# Altium schematic sheet DISPLAY.schdoc: =
size A4; Symbol: Sheet-Symbol_A4; Company: 嘉立创EDA; Version: V1.0; Page Size: A4; @Project Name: RK3568B2地瓜派; @Page Count: 27; @Update Date: 2025-09-23; @Create Date: 2025-09-11; @Schematic Name: Schematic1; @Page No: 25; @Page Name: DISPLAY; Device: Sheet-Symbol_A4; Border: 1; Title Block Position: 3; Width: 1170; Height: 825; Region Start: 1; X Region Count: 6; Y Region Count: 4; Blade Width: 10; @Board Name: Board1; @Create Time: 22:43:50; @Update Time: 10:18:57; Organization: ORGANIZATION; Address1: ADDRESS 1; Address2: ADDRESS 2; Address3: ADDRESS 3; Address4: ADDRESS 4; SheetNumber: 27; SheetTotal: 28
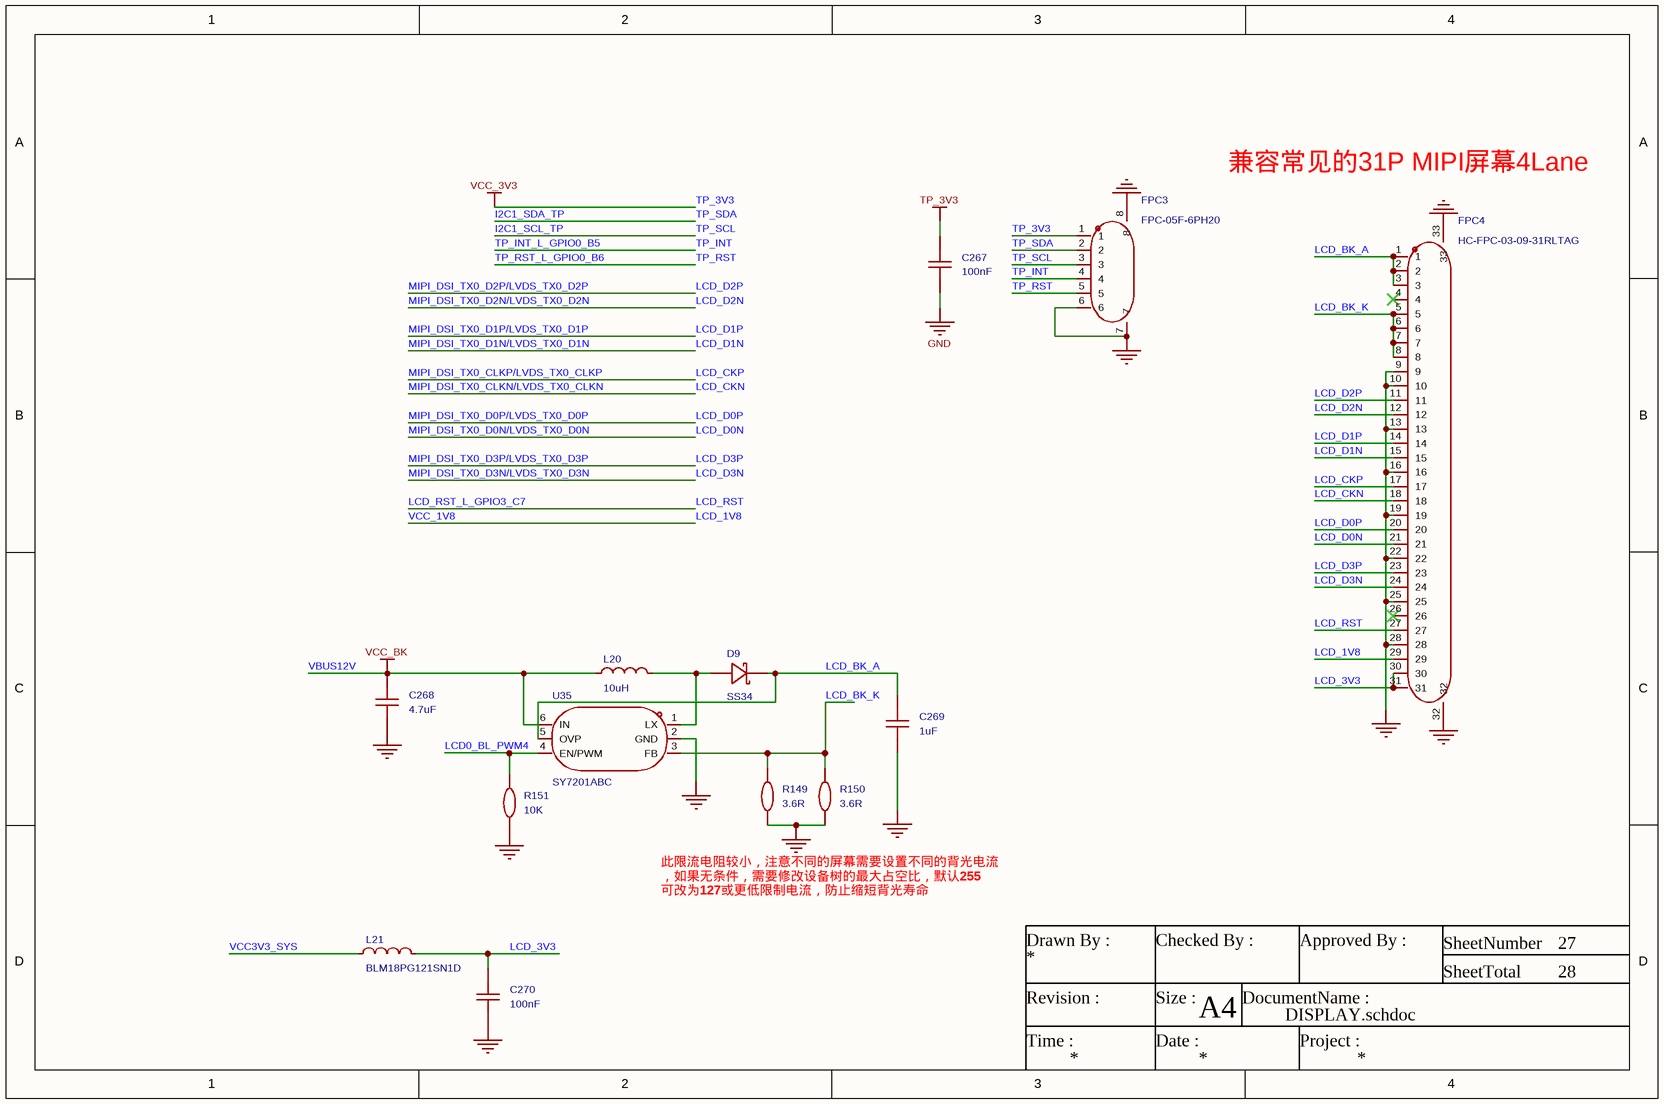
[diagram p0: DISPLAY.schdoc]

## Parts
C267  100nF  [C0603]
C268  4.7uF  [C0603]
C269  1uF  [C0603]
C270  100nF  [C0603]
D9  SS34  [SMA_L4.3-W2.6-LS5.0-FD]
FPC3  FPC-05F-6PH20  [FPC-SMD_6P-P0.50_XUNPU_FPC-05F-6PH20]
FPC4  HC-FPC-03-09-31RLTAG  [FPC-SMD_31P-P0.30_HC-FPC-03-09-31RLTAG]
L20  10uH  [IND-SMD_L2.5-W2.0]
L21  BLM18PG121SN1D  [L0603]
R149  3.6R  [R0603]
R150  3.6R  [R0603]
R151  10K  [R0402]
U35  SY7201ABC  [SOT-23-6_L2.9-W1.6-P0.95-LS2.8-BR]

## Nets
GND: C267.1 C268.1 C269.1 C270.1 FPC3.6 FPC3.7 FPC3.8 FPC4.9 FPC4.10 FPC4.13 FPC4.16 FPC4.19 FPC4.22 FPC4.25 FPC4.28 FPC4.32 FPC4.33 R149.1 R150.1 R151.1 U35.2(GND)
TP_3V3: C267.2 FPC3.1  [also labelled VCC_3V3]
VBUS12V: C268.2 L20.2 U35.6(IN)  [also labelled VCC_BK]
I2C1_SCL_TP: FPC3.3  [also labelled TP_SCL]
I2C1_SDA_TP: FPC3.2  [also labelled TP_SDA]
LCD0_BL_PWM4: R151.2 U35.4(EN/PWM)
LCD_1V8: FPC4.29  [also labelled VCC_1V8]
LCD_3V3: C270.2 FPC4.30 FPC4.31 L21.2
LCD_BK_A: C269.2 D9.2(K) FPC4.1 FPC4.2 FPC4.3 U35.5(OVP)
LCD_BK_K: FPC4.5 FPC4.6 FPC4.7 FPC4.8 R149.2 R150.2 U35.3(FB)
LCD_CKN: FPC4.18  [also labelled MIPI_DSI_TX0_CLKN/LVDS_TX0_CLKN]
LCD_CKP: FPC4.17  [also labelled MIPI_DSI_TX0_CLKP/LVDS_TX0_CLKP]
LCD_D0N: FPC4.21  [also labelled MIPI_DSI_TX0_D0N/LVDS_TX0_D0N]
LCD_D0P: FPC4.20  [also labelled MIPI_DSI_TX0_D0P/LVDS_TX0_D0P]
LCD_D1N: FPC4.15  [also labelled MIPI_DSI_TX0_D1N/LVDS_TX0_D1N]
LCD_D1P: FPC4.14  [also labelled MIPI_DSI_TX0_D1P/LVDS_TX0_D1P]
LCD_D2N: FPC4.12  [also labelled MIPI_DSI_TX0_D2N/LVDS_TX0_D2N]
LCD_D2P: FPC4.11  [also labelled MIPI_DSI_TX0_D2P/LVDS_TX0_D2P]
LCD_D3N: FPC4.24  [also labelled MIPI_DSI_TX0_D3N/LVDS_TX0_D3N]
LCD_D3P: FPC4.23  [also labelled MIPI_DSI_TX0_D3P/LVDS_TX0_D3P]
LCD_RST: FPC4.27  [also labelled LCD_RST_L_GPIO3_C7]
TP_INT: FPC3.4  [also labelled TP_INT_L_GPIO0_B5]
TP_RST: FPC3.5  [also labelled TP_RST_L_GPIO0_B6]
VCC3V3_SYS: L21.1
NetD9_1: D9.1(A) L20.1 U35.1(LX)

Not connected (* = marked no-connect by the designer): FPC4 4* 26*

## Notes on the sheet
- 兼容常见的31P MIPI屏幕4Lane
- 此限流电阻较小，注意不同的屏幕需要设置不同的背光电流
  ，如果无条件，需要修改设备树的最大占空比，默认255
  可改为127或更低限制电流，防止缩短背光寿命
- Drawn By :
- Checked By :
- Approved By :
- SheetNumber
- SheetTotal
- Revision :
- Time :
- Size :
- Date :
- A4
- DocumentName :
- Project :

## Library data of the parts
C267 = CAP_0603: Symbol: Capacitance; 3D Model: ac125912035d415993ca9572d50418b1聨0819f05c4eef4c71ace90d822a990e87; 3D Model Transform: 62.992,31.496,0,0,0,0,0,0,0; ConvertToPcb: yes; ModelName: C0603_L1.6-W0.8-H0.8; Device: CAP_0603; Supplier Footprint: 0603; Value: 100nF; AddInBom: yes; FootprintName: C0603
C268-C270 = CAP_0603: ConvertToPcb: yes; SymbolName: Capacitance; ModelId: ac125912035d415993ca9572d50418b1; ModelName: C0603_L1.6-W0.8-H0.8; ModelTransform: 62.992,31.496,0,0,0,0,0,0,0; Device: CAP_0603; AddInBom: yes; Supplier Footprint: 0603; FootprintName: C0603
  C268: Value: 4.7uF
  C269: Value: 1uF
  C270: Value: 100nF
D9 = SS34_C7420365: 二极管配置:独立式;正向压降(Vf):550mV@3.0A;直流反向耐压(Vr):40V;平均整流电流(Io):3A;; Manufacturer: 宏迦橙; Voltage - DC Reverse(Vr): 40V; Current - Rectified: 3A; AddInBom: yes; ModelId: 7e24bebe6cd74171ae8c9de6fc5b78aa; ModelTransform: 198.4248,103.5431,0,180,0,0,0,0,0; Diode Configuration: 独立式; Reverse Leakage Current (Ir): 200uA@40V; Peak forward surge current: 80A; Voltage - Forward(Vf@If): 550mV@3.0A; Symbol: SS34_C7420365; Device: SS34_C7420365; LCSC Part Name: 电压:40V 电流:3A; SupplierPart: C7420365; ManufacturerPart: SS34; Supplier Footprint: SMA(DO-214AC); JLCPCB Part Class: 扩展库; Datasheet: https://atta.szlcsc.com/upload/public/pdf/source/20230828/75438452AEE6C276EDA92B2AF599BE05.pdf; Supplier: LCSC; ConvertToPcb: yes; FootprintName: SMA_L4.3-W2.6-LS5.0-FD; ModelName: SMA_L4.3-W2.6-LS5.0-FD; Forward Voltage (Vf@If): 550mV@3.0A; Reverse Voltage (Vr): 40V; Average Rectified Current (Io): 3A
FPC3 = FPC-05F-6PH20: 锁定特性:翻盖式;触点类型:下接;触点数量:6P;间距:0.5mm;安装类型:卧贴;工作温度范围:-25℃~+85℃;; Manufacturer: XUNPU(讯普); AddInBom: yes; ModelId: f0153d283bb647ab8cc6ddf5c8ee15be; ModelTransform: 291.338,220.472,0,0,0,0,-0.001,-45.276,0; Locking Feature: 翻盖式; Number of Contacts: 6P; Pitch: 0.5mm; FFC, FCB Thickness: 0.3mm; Symbol: FPC-05F-6PH20; Device: FPC-05F-6PH20; LCSC Part Name: 间距:0.5mm P数:6P 翻盖式 下接; SupplierPart: C2856796; ManufacturerPart: FPC-05F-6PH20; Supplier Footprint: SMD,P=0.5mm,卧贴; JLCPCB Part Class: 扩展库; Datasheet: https://atta.szlcsc.com/upload/public/pdf/source/20210922/16B003FB53336DDF6538142CC465AC4D.pdf; Supplier: LCSC; ConvertToPcb: yes; FootprintName: FPC-SMD_6P-P0.50_XUNPU_FPC-05F-6PH20; ModelName: FPC-SMD_6P-P0.50_XUNPU_FPC-05F-6PH20; Contact Type: 下接; Mounting Type: 卧贴; Height Above Board: 2mm; Operating Temperature Range: -25℃~+85℃
FPC4 = HC-FPC-03-09-31RLTAG: 锁定特性:翻盖式;触点类型:下接;触点数量:31P;间距:0.3mm;安装方式:卧贴;工作温度:-55℃~+85℃;; Manufacturer: HCTL(华灿天禄); AddInBom: yes; ModelId: 8147d33ff0454235b0911f8aacb2567f; ModelTransform: 453.1487,167.3225,0,0,0,0,0,-13.78,0; Locking Feature: 翻盖式; Number of Contacts: 31P; Pitch: 0.3mm; FFC, FCB Thickness: 0.2mm; Symbol: HC-FPC-03-09-31RLTAG; Device: HC-FPC-03-09-31RLTAG; LCSC Part Name: 翻盖式 下接 P数:31P 间距:0.3mm; SupplierPart: C5213720; ManufacturerPart: HC-FPC-03-09-31RLTAG; Supplier Footprint: SMD,P=0.3mm,卧贴; JLCPCB Part Class: 扩展库; Datasheet: https://item.szlcsc.com/datasheet/HC-FPC-03-09-31RLTAG/5909012.html; Supplier: LCSC; ConvertToPcb: yes; FootprintName: FPC-SMD_31P-P0.30_HC-FPC-03-09-31RLTAG; ModelName: FPC-SMD_31P-P0.30_HC-FPC-03-09-31RLTAG; Contact Type: 下接; Mounting Type: 卧贴; Height Above Board: 1mm; Contact Material: 磷青铜; Operating Temperature: -55℃~+85℃
L20 = FTC252012S100MBCA: 电感值:10uH;精度:±20%;额定电流:1.2A;饱和电流(Isat):1.6A;类型:一体成型电感;; Manufacturer: cjiang(长江微电); AddInBom: yes; ModelId: 85d117b4abb34d9087271edcd9ba0330; ModelName: IND-SMD_L2.5-W2.0-H1.2; ModelTransform: 99.2124,78.74,0,0,0,0,0,0,0; Tolerance: ±20%; Rated Current: 1.2A; Saturation Current (Isat): 1.6A; DC Resistance (DCR): 330mΩ; Type: 一体成型电感; Symbol: FTC252012S100MBCA; Device: FTC252012S100MBCA; LCSC Part Name: 10uH ±20% 1.6A; SupplierPart: C5832376; ManufacturerPart: FTC252012S100MBCA; Supplier Footprint: SMD,2x2.5mm; JLCPCB Part Class: 扩展库; Datasheet: https://atta.szlcsc.com/upload/public/pdf/source/20230602/8FFEDA9C0247A92A0D4B67554BFE4091.pdf; Supplier: LCSC; ConvertToPcb: yes; FootprintName: IND-SMD_L2.5-W2.0; Value: 10uH
L21 = BLM18PG121SN1D: 标称阻抗@测试频率:120Ω@100MHz;误差:±25%;直流电阻(RDC):50mΩ;; Manufacturer: muRata(村田); DC Resistance(DCR): 50mΩ; Number of Circuits: 1; Symbol: BLM18PG121SN1D_C14709; AddInBom: yes; ModelId: 2bc5ec593d464d6ba9807aec0b5673c2; ModelName: L0603_L1.6-W0.8-H0.5_BEAD; ModelTransform: 62.992,31.496,0,180,0,0,0.094,0.629,0; Tolerance: ±25%; Current Rating: 2A; Operating Temperature: -55℃~+125℃; Device: BLM18PG121SN1D; LCSC Part Name: 单路 0603磁珠 阻抗120Ω@100MHz; SupplierPart: C14709; ManufacturerPart: BLM18PG121SN1D; Supplier Footprint: 0603; JLCPCB Part Class: 基础库; Datasheet: https://atta.szlcsc.com/upload/public/pdf/source/20130704/1457706621422.pdf; Supplier: LCSC; ConvertToPcb: yes; FootprintName: L0603; Impedance @ Frequency: 120Ω@100MHz; DC Resistance: 50mΩ; Circuits: 1
R149 R150 = Res_0603: Symbol: 电阻; ConvertToPcb: yes; ModelId: fc143cca1e79419f9cd78b61e9279f08; ModelTransform: 31.8897,63.7794,0,90,0,0,0,0,0; Value: 3.6R; Device: Res_0603; AddInBom: yes; Supplier Footprint: 0603; FootprintName: R0603; ModelName: R0603
R151 = Res_0402: Symbol: 电阻; ConvertToPcb: yes; ModelId: 671aefced39d4c318694bba8bd8efd39; ModelName: R0402_L1.0-W0.5-H0.5; ModelTransform: 39.37,19.685,0,0,0,0,0,0.0005,0; Device: Res_0402; AddInBom: yes; Supplier Footprint: 0402; FootprintName: R0402; Value: 10K
U35 = SY7201ABC: 拓扑结构:升压;; Manufacturer: Silergy(矽力杰); AddInBom: yes; ModelId: 18da8f6c14a34920b3e136b5c401a119; ModelName: SOT-23-6_L2.9-W1.6-H1.5-LS2.8-P0.95; ModelTransform: 110.73671,114.173,0,180,0,0,0.001,-0.003,0; Topology: 升压; Symbol: SY7201ABC; Device: SY7201ABC; LCSC Part Name: SY7201ABC; SupplierPart: C82173; ManufacturerPart: SY7201ABC; Supplier Footprint: SOT-23-6; JLCPCB Part Class: 扩展库; Datasheet: https://atta.szlcsc.com/upload/public/pdf/source/20160903/1472896628181.pdf; Supplier: LCSC; ConvertToPcb: yes; FootprintName: SOT-23-6_L2.9-W1.6-P0.95-LS2.8-BR